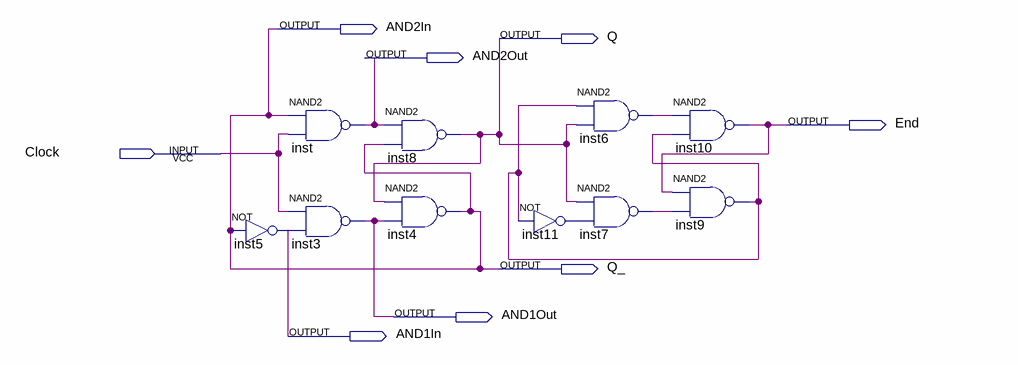
[diagram p0: schematic sheet]
// Quartus schematic CPLD.bdf as structural Verilog: 10 symbols, 8 pins
module CPLD (
  input  Clock,
  output AND2In,
  output Q,
  output AND2Out,
  output End,
  output Q_,
  output AND1Out,
  output AND1In
);

  wire inst6_out, inst7_out, inst9_out, inst11_out;

  not inst5 (AND1In, AND2In);
  nand inst (AND2Out, AND2In, Clock);
  nand inst3 (AND1Out, Clock, AND1In);
  nand inst8 (Q, AND2Out, AND2In);
  nand inst4 (AND2In, Q, AND1Out);
  not inst11 (inst11_out, inst9_out);
  nand inst6 (inst6_out, inst9_out, Q);
  nand inst7 (inst7_out, Q, inst11_out);
  nand inst10 (End, inst6_out, inst9_out);
  nand inst9 (inst9_out, End, inst7_out);

  assign Q_ = AND2In;
endmodule
